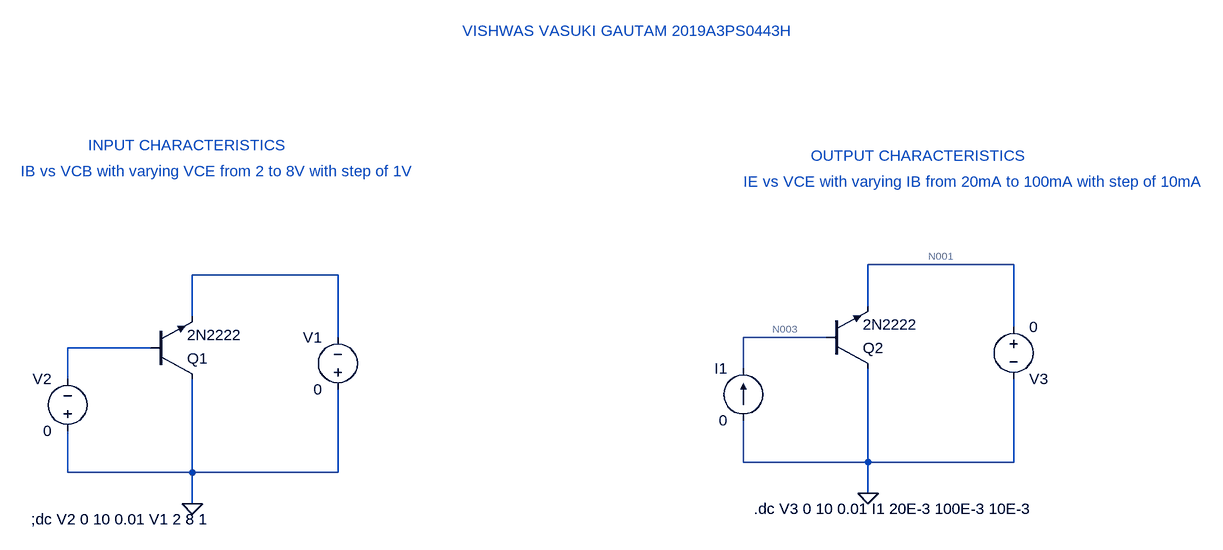
[diagram p0: schematic BJT_CC_characteristics.asc]
BJT_CC_characteristics.asc, the LTspice schematic file:
Version 4
SHEET 1 1772 680
WIRE 1344 -48 1120 -48
WIRE 304 -32 80 -32
WIRE 1120 16 1120 -48
WIRE 80 32 80 -32
WIRE 1344 48 1344 -48
WIRE 304 64 304 -32
WIRE 1056 64 928 64
WIRE 16 80 -112 80
WIRE 928 112 928 64
WIRE -112 128 -112 80
WIRE 928 256 928 192
WIRE 1120 256 1120 112
WIRE 1120 256 928 256
WIRE 1344 256 1344 128
WIRE 1344 256 1120 256
WIRE -112 272 -112 208
WIRE 80 272 80 128
WIRE 80 272 -112 272
WIRE 304 272 304 144
WIRE 304 272 80 272
WIRE 1120 304 1120 256
WIRE 80 320 80 272
FLAG 80 320 0
FLAG 1120 304 0
SYMBOL npn 16 128 M180
SYMATTR InstName Q1
SYMATTR Value 2N2222
SYMBOL voltage 304 160 R180
WINDOW 0 24 96 Left 2
WINDOW 3 24 16 Left 2
WINDOW 123 0 0 Left 2
WINDOW 39 0 0 Left 2
SYMATTR InstName V1
SYMATTR Value 0
SYMBOL voltage -112 224 R180
WINDOW 0 24 96 Left 2
WINDOW 3 24 16 Left 2
WINDOW 123 0 0 Left 2
WINDOW 39 0 0 Left 2
SYMATTR InstName V2
SYMATTR Value 0
SYMBOL npn 1056 112 M180
SYMATTR InstName Q2
SYMATTR Value 2N2222
SYMBOL voltage 1344 32 R0
WINDOW 0 24 96 Left 2
WINDOW 3 24 16 Left 2
WINDOW 123 0 0 Left 2
WINDOW 39 0 0 Left 2
SYMATTR InstName V3
SYMATTR Value 0
SYMBOL current 928 192 R180
WINDOW 0 24 80 Left 2
WINDOW 3 24 0 Left 2
WINDOW 123 0 0 Left 2
WINDOW 39 0 0 Left 2
SYMATTR InstName I1
SYMATTR Value 0
TEXT -168 344 Left 2 !;dc V2 0 10 0.01 V1 2 8 1
TEXT -80 -232 Left 2 ;INPUT CHARACTERISTICS
TEXT -184 -192 Left 2 ;IB vs VCB with varying VCE from 2 to 8V with step of 1V
TEXT 944 328 Left 2 !.dc V3 0 10 0.01 I1 20E-3 100E-3 10E-3
TEXT 1032 -216 Left 2 ;OUTPUT CHARACTERISTICS
TEXT 928 -176 Left 2 ;IE vs VCE with varying IB from 20mA to 100mA with step of 10mA
TEXT 496 -408 Left 2 ;VISHWAS VASUKI GAUTAM 2019A3PS0443H

The netlist it stands for:
* BJT_CC_characteristics.asc
Q1 0 N004 N002 0 2N2222
V1 0 N002 0
V2 0 N004 0
Q2 0 N003 N001 0 2N2222
V3 N001 0 0
I1 0 N003 0
.model NPN NPN
.model PNP PNP
.lib standard.bjt
;dc V2 0 10 0.01 V1 2 8 1
* INPUT CHARACTERISTICS
* IB vs VCB with varying VCE from 2 to 8V with step of 1V
.dc V3 0 10 0.01 I1 20E-3 100E-3 10E-3
* OUTPUT CHARACTERISTICS
* IE vs VCE with varying IB from 20mA to 100mA with step of 10mA
* VISHWAS VASUKI GAUTAM 2019A3PS0443H
.backanno
.end

* Results of the author's LTspice run, read from the files saved beside the schematic
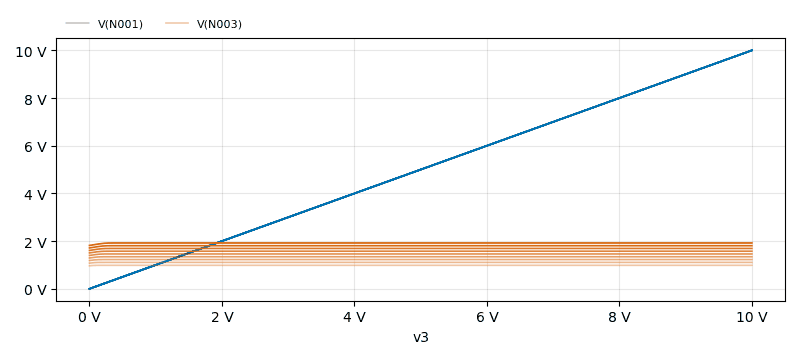
[diagram p1: DC transfer characteristic of BJT_CC_characteristics.asc, plotted from the saved traces]
* DC transfer characteristic, 9 runs:
*   V(N001) [i1=0.02]: 0 V at v3=0 V, 10 V at v3=10 V, min 0 V, max 10 V
*   V(N001) [i1=0.03]: 0 V at v3=0 V, 10 V at v3=10 V, min 0 V, max 10 V
*   V(N001) [i1=0.04]: 0 V at v3=0 V, 10 V at v3=10 V, min 0 V, max 10 V
*   V(N001) [i1=0.05]: 0 V at v3=0 V, 10 V at v3=10 V, min 0 V, max 10 V
*   V(N001) [i1=0.06]: 0 V at v3=0 V, 10 V at v3=10 V, min 0 V, max 10 V
*   V(N001) [i1=0.07]: 0 V at v3=0 V, 10 V at v3=10 V, min 0 V, max 10 V
*   V(N001) [i1=0.08]: 0 V at v3=0 V, 10 V at v3=10 V, min 0 V, max 10 V
*   V(N001) [i1=0.09]: 0 V at v3=0 V, 10 V at v3=10 V, min 0 V, max 10 V
*   V(N003) [i1=0.02]: 964.7 mV at v3=0 V, 984.9 mV at v3=10 V, min 964.7 mV, max 984.9 mV
*   V(N003) [i1=0.03]: 1.077 V at v3=0 V, 1.107 V at v3=10 V, min 1.077 V, max 1.107 V
*   V(N003) [i1=0.04]: 1.186 V at v3=0 V, 1.227 V at v3=10 V, min 1.186 V, max 1.227 V
*   V(N003) [i1=0.05]: 1.293 V at v3=0 V, 1.344 V at v3=10 V, min 1.293 V, max 1.344 V
*   V(N003) [i1=0.06]: 1.399 V at v3=0 V, 1.461 V at v3=10 V, min 1.399 V, max 1.461 V
*   V(N003) [i1=0.07]: 1.505 V at v3=0 V, 1.577 V at v3=10 V, min 1.505 V, max 1.577 V
*   V(N003) [i1=0.08]: 1.609 V at v3=0 V, 1.692 V at v3=10 V, min 1.609 V, max 1.692 V
*   V(N003) [i1=0.09]: 1.714 V at v3=0 V, 1.807 V at v3=10 V, min 1.714 V, max 1.807 V